# Altium schematic sheet ButtonBuffering.SchDoc
size A
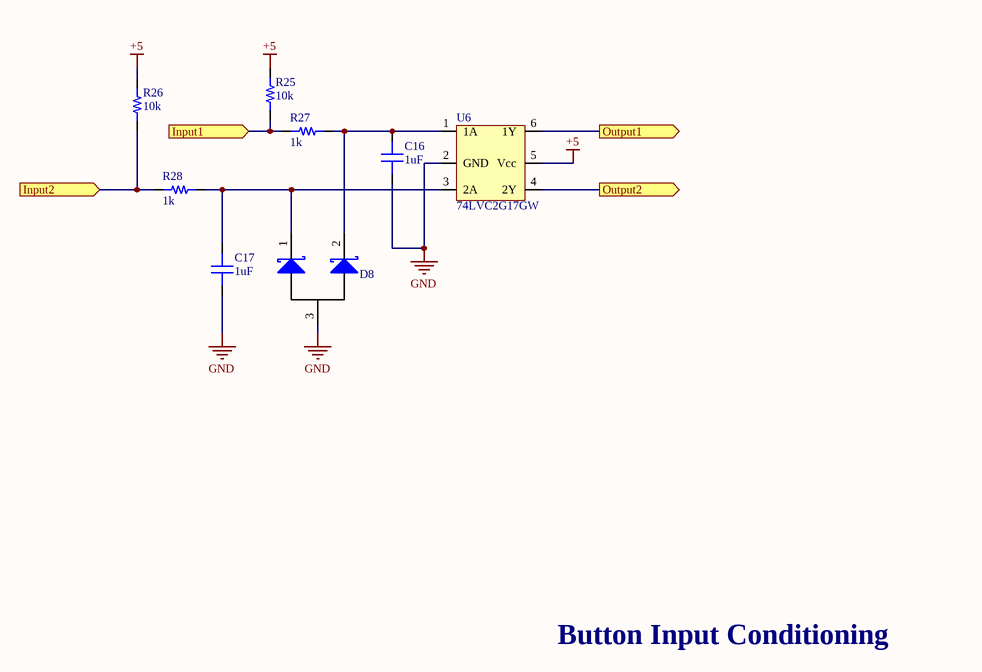
[diagram p0: ButtonBuffering.SchDoc]

## Parts
C16  capacitance: 1uF  [0603]  (hidden comment: capacitor)
C17  capacitance: 1uF  [0603]  (hidden comment: capacitor)
D8  AZ23C4V7-7-F Dual Zenner Diodes  [SOT23-3]  (value not drawn)
R25  10k  [RES 0603/1608]
R26  10k  [RES 0603/1608]
R27  1k  [RES 0603/1608]
R28  1k  [RES 0603/1608]
U6  74LVC2G17GW  [TSOP95P280X110-6N]

## Ports
Input1 (in), Input2 (in), Output1 (out), Output2 (out)

## Nets
+5: R25.2 R26.2 U6.5(Vcc)
GND: C16.1 C17.1 D8.3 U6.2(GND)
Input1: R25.1 R27.1 ; port Input1
Input2: R26.1 R28.1 ; port Input2
Output1: U6.6(1Y) ; port Output1
Output2: U6.4(2Y) ; port Output2
NetC16_2: C16.2 D8.2 R27.2 U6.1(1A)
NetC17_2: C17.2 D8.1 R28.2 U6.3(2A)

## Notes on the sheet
- Button Input Conditioning

## Library data of the parts
C16 C17 = 1: Generic 0603 capacitor; id: 1; voltage: 50; dielectric: Ceramic; percent tolerance: 10; name: 0603 Capacitor; ESR: 1; package: 0603; quantity: 0
D8 = 14: DIODE ZENER ARRAY 4.7V SOT23-3; id: 14; name: AZ23C4V7-7-F; package: SOT23-3; quantity: 0; link: https://www.digikey.com/product-detail/en/diodes-incorporated/AZ23C4V7-7-F/AZ23C4V7-FDICT-ND/815309
R25 R26 = 1: id: 1; name: 0603 Resistor; percent tolerance: 5; resistance: 10k; package: 0603; quantity: 0
R27 R28 = 1: id: 1; resistance: 1k
U6 = 17: Buffer, Non-Inverting 2 Element 1 Bit per Element Push-Pull Output 6-TSSOP; id: 17; vcc: 5; updatedby: Nolan; name: 74LVC2G17; type: buffer; package: SOT457; quantity: 0; createdby: Nolan; createddate: 10/16/2019 10:08:58 PM; updateddate: 10/16/2019 10:08:58 PM